# EAGLE schematic schematics1 (EAGLE 6.1)
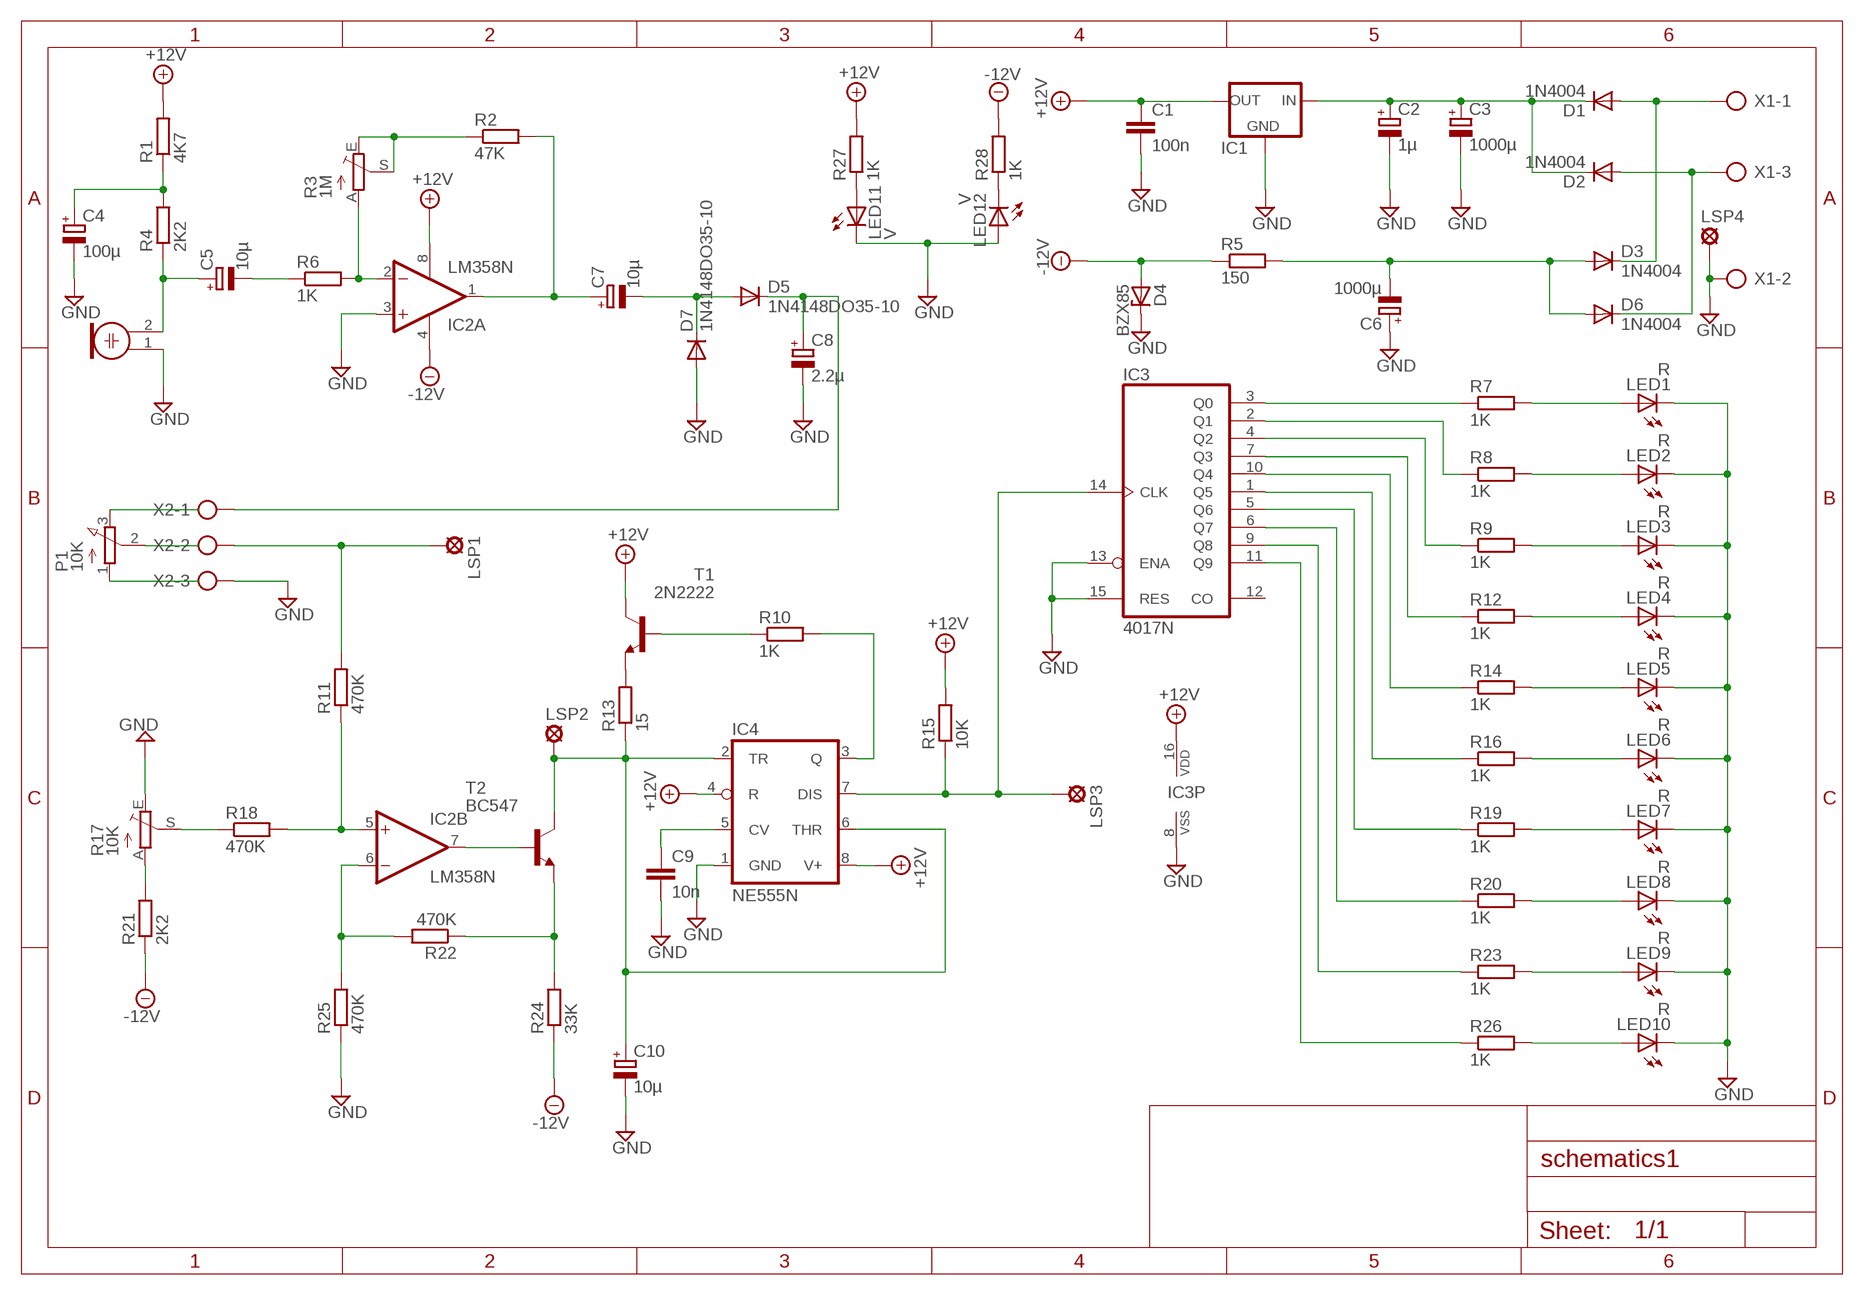
[diagram p0: schematic, sheet 1]

## Parts
C1  100n  C-EU050-035X075  [C050-035X075]
C2  1µ  CPOL-EUE2-4  [E2-4]
C3  1000µ  CPOL-EUE5-13  [E5-13]
C4  100µ  CPOL-EUE2.5-6  [E2,5-6]
C5  10µ  CPOL-EUE2-5  [E2-5]
C6  1000µ  CPOL-EUE5-13  [E5-13]
C7  10µ  CPOL-EUE2-5  [E2-5]
C8  2.2µ  CPOL-EUE2-5  [E2-5]
C9  10n  C-EU050-035X075  [C050-035X075]
C10  10µ  CPOL-EUE2-5  [E2-5]
D1  1N4004  [DO41-10]
D2  1N4004  [DO41-10]
D3  1N4004  [DO41-10]
D4  BZX85  [DO41Z10]
D5  1N4148DO35-10  [DO35-10]
D6  1N4004  [DO41-10]
D7  1N4148DO35-10  [DO35-10]
IC1  78XXS  [78XXS]
IC2  LM358N  [DIL08]
IC3  4017N  [DIL16]
IC4  NE555N  [DIL08]
LED1  R  LED5MM  [LED5MM]
LED2  R  LED5MM  [LED5MM]
LED3  R  LED5MM  [LED5MM]
LED4  R  LED5MM  [LED5MM]
LED5  R  LED5MM  [LED5MM]
LED6  R  LED5MM  [LED5MM]
LED7  R  LED5MM  [LED5MM]
LED8  R  LED5MM  [LED5MM]
LED9  R  LED5MM  [LED5MM]
LED10  R  LED5MM  [LED5MM]
LED11  V  LED5MM  [LED5MM]
LED12  V  LED5MM  [LED5MM]
LSP1  LSP10  [LSP10]
LSP2  LSP10  [LSP10]
LSP3  LSP10  [LSP10]
LSP4  LSP10  [LSP10]
M2  ELECTRET_MICROPHON-F6050AP  [F6050AP]
P1  10K  3RP/1610N  [3RP/1610N]
R1  4K7  R-EU_0207/12  [0207/12]
R2  47K  R-EU_0207/12  [0207/12]
R3  1M  TRIM_EU-CA9V  [CA9V]
R4  2K2  R-EU_0207/12  [0207/12]
R5  150  R-EU_0207/12  [0207/12]
R6  1K  R-EU_0207/12  [0207/12]
R7  1K  R-EU_0207/12  [0207/12]
R8  1K  R-EU_0207/12  [0207/12]
R9  1K  R-EU_0207/12  [0207/12]
R10  1K  R-EU_0207/12  [0207/12]
R11  470K  R-EU_0207/12  [0207/12]
R12  1K  R-EU_0207/12  [0207/12]
R13  15  R-EU_0207/12  [0207/12]
R14  1K  R-EU_0207/12  [0207/12]
R15  10K  R-EU_0207/12  [0207/12]
R16  1K  R-EU_0207/12  [0207/12]
R17  10K  TRIM_EU-CA9V  [CA9V]
R18  470K  R-EU_0207/12  [0207/12]
R19  1K  R-EU_0207/12  [0207/12]
R20  1K  R-EU_0207/12  [0207/12]
R21  2K2  R-EU_0207/12  [0207/12]
R22  470K  R-EU_0207/12  [0207/12]
R23  1K  R-EU_0207/12  [0207/12]
R24  33K  R-EU_0207/12  [0207/12]
R25  470K  R-EU_0207/12  [0207/12]
R26  1K  R-EU_0207/12  [0207/12]
R27  1K  R-EU_0207/12  [0207/12]
R28  1K  R-EU_0207/12  [0207/12]
T1  2N2222  [TO18]
T2  BC547  [TO92]
X1  AK300/3  [AK300/3]
X2  AK300/3  [AK300/3]

## Nets
+12V: C1.1 IC1.OUT IC2.8(P:V+) IC3.16(VDD) IC4.4(R) IC4.8(V+) R1.2 R15.2 R27.2 T1.3(C)
-12V: D4.A IC2.4(P:V-) R5.1 R21.1 R24.1 R28.2
GND: C1.2 C2.- C3.- C4.- C6.+ C8.- C9.2 C10.- D4.C D7.A IC1.GND IC2.3(A:+IN) IC3.8(VSS) IC3.13(ENA) IC3.15(RES) IC4.1(GND) LED1.K(C) LED2.K(C) LED3.K(C) LED4.K(C) LED5.K(C) LED6.K(C) LED7.K(C) LED8.K(C) LED9.K(C) LED10.K(C) LED11.K(C) LED12.A LSP4.MP M2.1 R17.E R25.1 X1.2 X2.3
N$1: LED1.A R7.2
N$2: LED2.A R8.2
N$3: LED3.A R9.2
N$4: LED4.A R12.2
N$5: LED5.A R14.2
N$6: LED6.A R16.2
N$7: LED7.A R19.2
N$8: LED8.A R20.2
N$9: LED9.A R23.2
N$10: LED10.A R26.2
N$11: IC3.3(Q0) R7.1
N$12: IC3.2(Q1) R8.1
N$13: IC3.4(Q2) R9.1
N$14: IC3.7(Q3) R12.1
N$15: IC3.10(Q4) R14.1
N$16: IC3.1(Q5) R16.1
N$17: IC3.5(Q6) R19.1
N$18: IC3.6(Q7) R20.1
N$19: IC3.9(Q8) R23.1
N$20: IC3.11(Q9) R26.1
N$21: LSP1.MP R11.2 X2.2
N$22: IC2.5(B:+IN) R11.1 R18.2
N$23: R17.A R21.2
N$24: IC2.6(B:-IN) R22.2 R25.2
N$25: R22.1 R24.2 T2.1(E)
N$26: C5.+ M2.2 R4.1
N$27: C4.+ R1.1 R4.2
N$28: C5.- R6.1
N$29: IC2.2(A:-IN) R3.A R6.2
N$30: R2.1 R3.E R3.S
N$31: C7.+ IC2.1(A:OUT) R2.2
N$32: C8.+ D5.C X2.1
N$33: P1.3(E)
N$34: C7.- D5.A D7.C
N$35: P1.2(S)
N$36: P1.1(A)
N$37: IC2.7(B:OUT) T2.2(B)
N$38: R17.S R18.1
N$40: C9.1 IC4.5(CV)
N$41: R13.2 T1.1(E)
N$42: R10.1 T1.2(B)
N$43: IC4.3(Q) R10.2
N$44: IC3.14(CLK) IC4.7(DIS) LSP3.MP R15.1
N$45: D1.A D3.C X1.1
N$46: D2.A D6.C X1.3
N$47: LED11.A R27.1
N$48: C2.+ C3.+ D1.C D2.C IC1.IN
N$49: C6.- D3.A D6.A R5.2
N$50: LED12.K(C) R28.1
N$52: C10.+ IC4.2(TR) IC4.6(THR) LSP2.MP R13.1 T2.3(C)
Unconnected: IC3.12(CO)

## Library data of the parts
C1 C9 = rcl:C-EU: CAPACITOR, European symbol
C2-C8 C10 = rcl:CPOL-EU: POLARIZED CAPACITOR, European symbol
D1-D3 D6 = diode:1N4004: DIODE general purpose rectifier, 1 A
D4 = diode:BZX85: Z DIODE
D5 D7 = diode:1N4148: DIODE high speed (Philips)
IC1 = v-reg:78XXS: VOLTAGE REGULATOR
IC2 = linear:LM358: OP AMP also LM158; LM258; LM2904 Source: http://cache.national.com/ds/LM/LM158.pdf
IC3 = 40xx:4017: COUNTER/DIVIDER
IC4 = linear:*555: TIMER
LED1-LED12 = led:LED: LED OSRAM: - CHIPLED LG R971, LG N971, LY N971, LG Q971, LY Q971, LO R971, LY R971 LH N974, LH R974 LS Q976, LO Q976, LY Q976 LO Q996 - Hyper CHIPLED LW Q18S LB Q993, LB Q99A, LB R99A - SideLED LS A670, LO A670, LY A670, LG A670, LP A670 LB A673, LV A673, LT A673, LW A673 LH A674 LY A675 LS A676, LA A676, LO A676, LY A676, LW A676 LS A679, LY A679, LG A679 - Hyper Micro SIDELED® LS Y876, LA Y876, LO Y876, LY Y876 LT Y87S - SmartLED LW L88C, LW L88S LB L89C, LB L89S, LG L890 LS L89K, LO L89K, LY L89K LS L896, LA L896, LO L896, LY L896 - TOPLED LS T670, LO T670, LY T670, LG T670, LP T670 LSG T670, LSP T670, LSY T670, LOP T670, LYG T670 LG T671, LOG T671, LSG T671 LB T673, LV T673, LT T673, LW T673 LH T674 LS T676, LA T676, LO T676, LY T676, LB T676, LH T676, LSB T676, LW T676 LB T67C, LV T67C, LT T67C, LS T67K, LO T67K, LY T67K, LW E67C LS E67B, LA E67B, LO E67B, LY E67B, LB E67C, LV E67C, LT E67C LW T67C LS T679, LY T679, LG T679 LS T770, LO T770, LY T770, LG T770, LP T770 LB T773, LV T773, LT T773, LW T773 LH T774 LS E675, LA E675, LY E675, LS T675 LS T776, LA T776, LO T776, LY T776, LB T776 LHGB T686 LT T68C, LB T68C - Hyper Mini TOPLED® LB M676 - Mini TOPLED Santana® LG M470 LS M47K, LO M47K, LY M47K Source: http://www.osram.convergy.de LUXEON: - LUMILED® LXK2-PW12-R00, LXK2-PW12-S00, LXK2-PW14-U00, LXK2-PW14-V00 LXK2-PM12-R00, LXK2-PM12-S00, LXK2-PM14-U00 LXK2-PE12-Q00, LXK2-PE12-R00, LXK2-PE12-S00, LXK2-PE14-T00, LXK2-PE14-U00 LXK2-PB12-K00, LXK2-PB12-L00, LXK2-PB12-M00, LXK2-PB14-N00, LXK2-PB14-P00, LXK2-PB14-Q00 LXK2-PR12-L00, LXK2-PR12-M00, LXK2-PR14-Q00, LXK2-PR14-R00 LXK2-PD12-Q00, LXK2-PD12-R00, LXK2-PD12-S00 LXK2-PH12-R00, LXK2-PH12-S00 LXK2-PL12-P00, LXK2-PL12-Q00, LXK2-PL12-R00 Source: www.luxeon.com KINGBRIGHT: KA-3528ASYC Source: www.kingbright.com
LSP1-LSP4 = solpad:LSP10: SOLDER PAD drill 1.0 mm, distributor Buerklin, 12H555
M2 = microphon:ELECTRET_MICROPHON-: Electret Condenser Microphone
P1 = pot:3RP/1610N: 16mm Potentiometer one level Source: http://www.alphapotentiometers.net/html/16mm_pot_2.html
R1 R2 R4-R16 R18-R28 = rcl:R-EU_: RESISTOR, European symbol
R3 R17 = pot:TRIM_EU-: POTENTIOMETER
T1 = transistor:2N2222: NPN TRANSISTOR
T2 = transistor:BC547: NPN TRANSISTOR
X1 X2 = con-ptr500:AK300/3: CONNECTOR; OC_FARNELL: unknown; OC_NEWARK: unknown